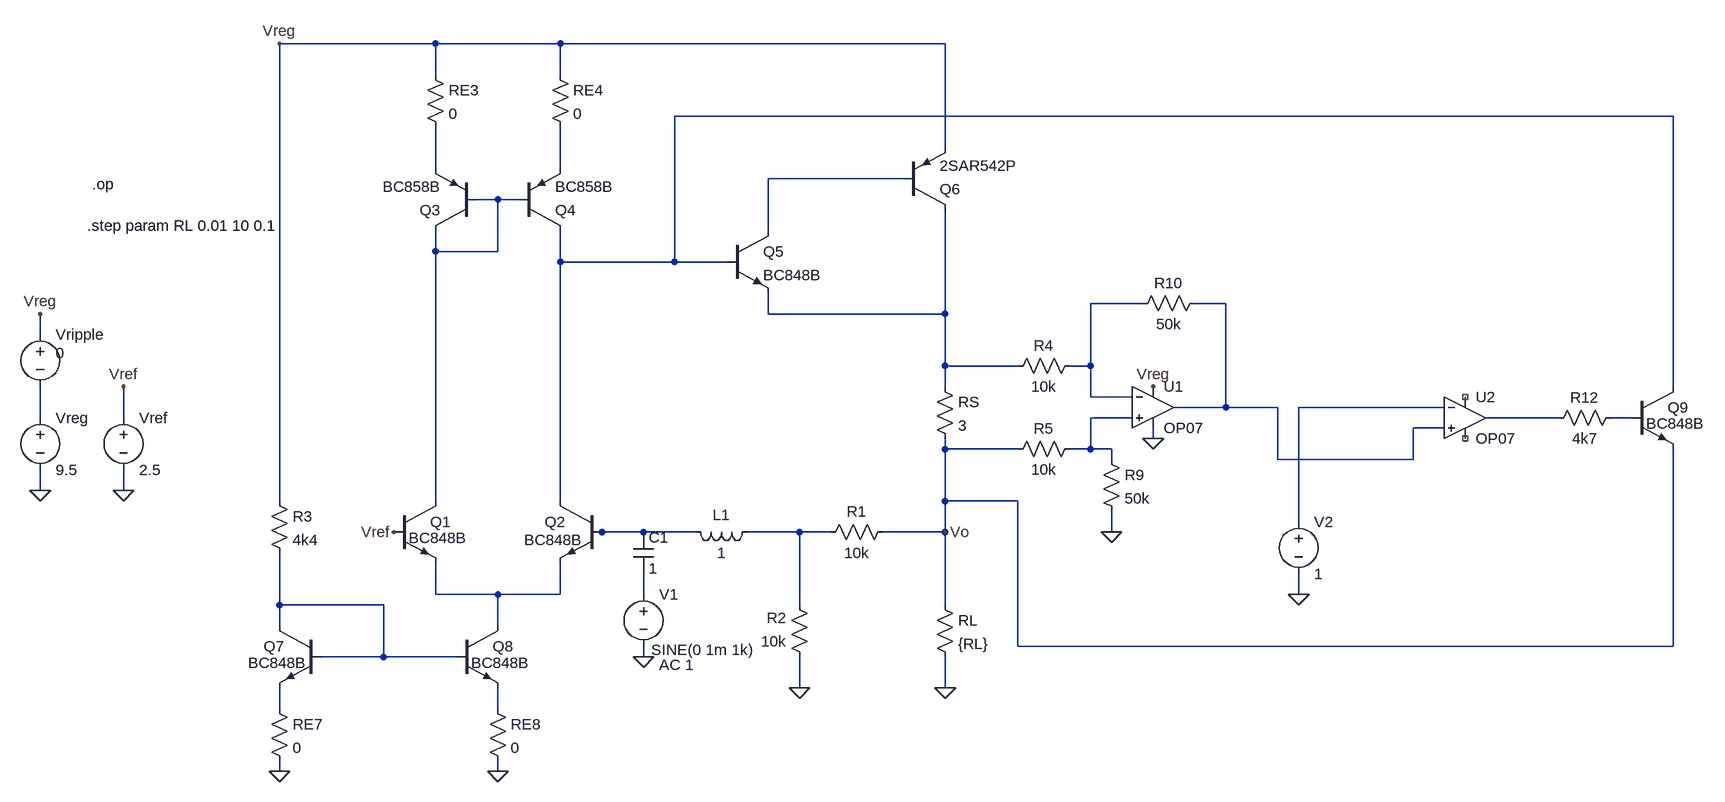
[diagram p0: schematic draft-circuitos-Fran.asc]
draft-circuitos-Fran.asc, the LTspice schematic file:
Version 4
SHEET 1 1876 736
WIRE -96 -416 -336 -416
WIRE 96 -416 -96 -416
WIRE 688 -416 96 -416
WIRE -96 -368 -96 -416
WIRE 96 -368 96 -416
WIRE 1808 -304 272 -304
WIRE 688 -256 688 -416
WIRE -96 -224 -96 -288
WIRE 96 -224 96 -288
WIRE 624 -208 416 -208
WIRE 0 -176 -32 -176
WIRE 32 -176 0 -176
WIRE 416 -128 416 -208
WIRE -96 -96 -96 -128
WIRE 0 -96 0 -176
WIRE 0 -96 -96 -96
WIRE 96 -80 96 -128
WIRE 272 -80 272 -304
WIRE 272 -80 96 -80
WIRE 352 -80 272 -80
WIRE 992 -16 912 -16
WIRE 1120 -16 1072 -16
WIRE 416 0 416 -32
WIRE 688 0 688 -160
WIRE 688 0 416 0
WIRE -704 32 -704 0
WIRE 688 80 688 0
WIRE 800 80 688 80
WIRE 912 80 912 -16
WIRE 912 80 880 80
WIRE 688 112 688 80
WIRE 1808 112 1808 -304
WIRE 912 128 912 80
WIRE 976 128 912 128
WIRE 1120 144 1120 -16
WIRE 1120 144 1040 144
WIRE 1200 144 1120 144
WIRE 1456 144 1232 144
WIRE -704 160 -704 112
WIRE -576 160 -576 112
WIRE 976 160 912 160
WIRE 1632 160 1520 160
WIRE 1744 160 1712 160
WIRE 1456 176 1408 176
WIRE 1008 192 1008 176
WIRE 688 208 688 192
WIRE 800 208 688 208
WIRE 912 208 912 160
WIRE 912 208 880 208
WIRE 944 208 912 208
WIRE 944 224 944 208
WIRE 1200 224 1200 144
WIRE 1408 224 1408 176
WIRE 1408 224 1200 224
WIRE -704 272 -704 240
WIRE -576 272 -576 240
WIRE -336 288 -336 -416
WIRE -96 288 -96 -96
WIRE 96 288 96 -80
WIRE 688 288 688 208
WIRE 800 288 688 288
WIRE 1232 320 1232 144
WIRE 160 336 144 336
WIRE 224 336 160 336
WIRE 304 336 224 336
WIRE 464 336 384 336
WIRE 512 336 464 336
WIRE 688 336 688 288
WIRE 688 336 592 336
WIRE 944 336 944 304
WIRE -96 432 -96 384
WIRE 0 432 -96 432
WIRE 96 432 96 384
WIRE 96 432 0 432
WIRE 224 432 224 400
WIRE 1232 432 1232 400
WIRE -336 448 -336 368
WIRE -176 448 -336 448
WIRE 464 448 464 336
WIRE 688 448 688 336
WIRE -336 480 -336 448
WIRE 0 480 0 432
WIRE 800 512 800 288
WIRE 1808 512 1808 208
WIRE 1808 512 800 512
WIRE -176 528 -176 448
WIRE -176 528 -272 528
WIRE -64 528 -176 528
WIRE 224 528 224 512
WIRE 464 576 464 528
WIRE 688 576 688 528
WIRE -336 608 -336 576
WIRE 0 608 0 576
WIRE -336 704 -336 688
WIRE 0 704 0 688
FLAG 688 576 0
FLAG 464 576 0
FLAG -576 272 0
FLAG -160 336 Vref
FLAG -576 112 Vref
FLAG -704 272 0
FLAG -704 0 Vreg
FLAG -336 -416 Vreg
FLAG 688 336 Vo
FLAG 224 528 0
FLAG -336 704 0
FLAG 0 704 0
FLAG 944 336 0
FLAG 1008 112 Vreg
FLAG 1008 192 0
FLAG 1232 432 0
SYMBOL pnp 624 -160 M180
SYMATTR InstName Q6
SYMATTR Value 2SAR542P
SYMBOL npn 352 -128 R0
SYMATTR InstName Q5
SYMATTR Value BC848B
SYMBOL npn -160 288 R0
WINDOW 3 23 57 Left 2
SYMATTR Value BC848B
SYMATTR InstName Q1
SYMBOL pnp 32 -128 M180
SYMATTR InstName Q4
SYMATTR Value BC858B
SYMBOL pnp -32 -128 R180
SYMATTR InstName Q3
SYMATTR Value BC858B
SYMBOL npn 160 288 M0
WINDOW 3 30 60 Left 2
SYMATTR Value BC848B
SYMATTR InstName Q2
SYMBOL res -112 -384 R0
SYMATTR InstName RE3
SYMATTR Value 0
SYMBOL res 80 -384 R0
SYMATTR InstName RE4
SYMATTR Value 0
SYMBOL npn -64 480 R0
WINDOW 3 23 57 Left 2
SYMATTR Value BC848B
SYMATTR InstName Q8
SYMBOL npn -272 480 M0
WINDOW 3 23 57 Left 2
SYMATTR Value BC848B
SYMATTR InstName Q7
SYMBOL res 608 320 R90
WINDOW 0 0 56 VBottom 2
WINDOW 3 32 56 VTop 2
SYMATTR InstName R1
SYMATTR Value 10k
SYMBOL res 480 544 R180
WINDOW 0 36 76 Left 2
WINDOW 3 36 40 Left 2
SYMATTR InstName R2
SYMATTR Value 10k
SYMBOL res -352 272 R0
SYMATTR InstName R3
SYMATTR Value 4k4
SYMBOL voltage -576 144 R0
WINDOW 123 0 0 Left 0
WINDOW 39 0 0 Left 0
SYMATTR InstName Vref
SYMATTR Value 2.5
SYMBOL voltage -704 144 R0
WINDOW 123 0 0 Left 0
WINDOW 39 0 0 Left 0
SYMATTR InstName Vreg
SYMATTR Value 9.5
SYMBOL voltage -704 16 R0
WINDOW 123 0 0 Left 0
WINDOW 39 0 0 Left 0
WINDOW 3 24 44 Left 2
SYMATTR Value 0
SYMATTR InstName Vripple
SYMBOL cap 208 336 R0
SYMATTR InstName C1
SYMATTR Value 1
SYMBOL voltage 224 416 R0
WINDOW 123 24 124 Left 2
WINDOW 39 0 0 Left 0
WINDOW 3 12 101 Left 2
SYMATTR Value2 AC 1
SYMATTR Value SINE(0 1m 1k)
SYMATTR InstName V1
SYMBOL ind 400 320 R90
WINDOW 0 5 56 VBottom 2
WINDOW 3 32 56 VTop 2
SYMATTR InstName L1
SYMATTR Value 1
SYMBOL res -352 592 R0
SYMATTR InstName RE7
SYMATTR Value 0
SYMBOL res -16 592 R0
SYMATTR InstName RE8
SYMATTR Value 0
SYMBOL OpAmps\\OP07 1008 80 R0
SYMATTR InstName U1
SYMBOL res 672 96 R0
SYMATTR InstName RS
SYMATTR Value 3
SYMBOL res 896 64 R90
WINDOW 0 0 56 VBottom 2
WINDOW 3 32 56 VTop 2
SYMATTR InstName R4
SYMATTR Value 10k
SYMBOL res 896 192 R90
WINDOW 0 0 56 VBottom 2
WINDOW 3 32 56 VTop 2
SYMATTR InstName R5
SYMATTR Value 10k
SYMBOL res 928 208 R0
SYMATTR InstName R9
SYMATTR Value 50k
SYMBOL res 1088 -32 R90
WINDOW 0 0 56 VBottom 2
WINDOW 3 32 56 VTop 2
SYMATTR InstName R10
SYMATTR Value 50k
SYMBOL OpAmps\\OP07 1488 96 R0
SYMATTR InstName U2
SYMBOL res 1728 144 R90
WINDOW 0 0 56 VBottom 2
WINDOW 3 32 56 VTop 2
SYMATTR InstName R12
SYMATTR Value 4k7
SYMBOL npn 1744 112 R0
WINDOW 3 23 57 Left 2
SYMATTR Value BC848B
SYMATTR InstName Q9
SYMBOL voltage 1232 304 R0
SYMATTR InstName V2
SYMATTR Value 1
SYMBOL res 672 432 R0
SYMATTR InstName RL
SYMATTR Value {RL}
TEXT -624 -200 Left 2 !.op
TEXT -632 -136 Left 2 !.step param RL 0.01 10 0.1

The netlist it stands for:
* draft-circuitos-Fran.asc
Q6 N008 N004 Vreg 0 2SAR542P
Q5 N004 N001 N008 0 BC848B
Q1 N005 Vref N016 0 BC848B
Q4 N001 N005 N003 0 BC858B
Q3 N005 N005 N002 0 BC858B
Q2 N001 N014 N016 0 BC848B
RE3 Vreg N002 0
RE4 Vreg N003 0
Q8 N016 N018 N020 0 BC848B
Q7 N018 N018 N019 0 BC848B
R1 Vo N015 10k
R2 0 N015 10k
R3 Vreg N018 4k4
Vref Vref 0 2.5
Vreg N010 0 9.5
Vripple Vreg N010 0
C1 N014 N017 1
V1 N017 0 SINE(0 1m 1k) AC 1
L1 N015 N014 1
RE7 N019 0 0
RE8 N020 0 0
XU1 N011 N006 Vreg 0 N007 LT1001  ; OP07, pins In+ In- V+ V- OUT
RS N008 Vo 3
R4 N006 N008 10k
R5 N011 Vo 10k
R9 N011 0 50k
R10 N007 N006 50k
XU2 N007 N009 NC_01 NC_02 N012 LT1001  ; OP07, pins In+ In- V+ V- OUT
R12 N013 N012 4k7
Q9 N001 N013 Vo 0 BC848B
V2 N009 0 1
RL Vo 0 {RL}
.model NPN NPN
.model PNP PNP
.lib standard.bjt
.op
.step param RL 0.01 10 0.1
.lib LTC.lib
.backanno
.end